# EAGLE design New_Multirotor_GPS_V1.2 (EAGLE 6.3)
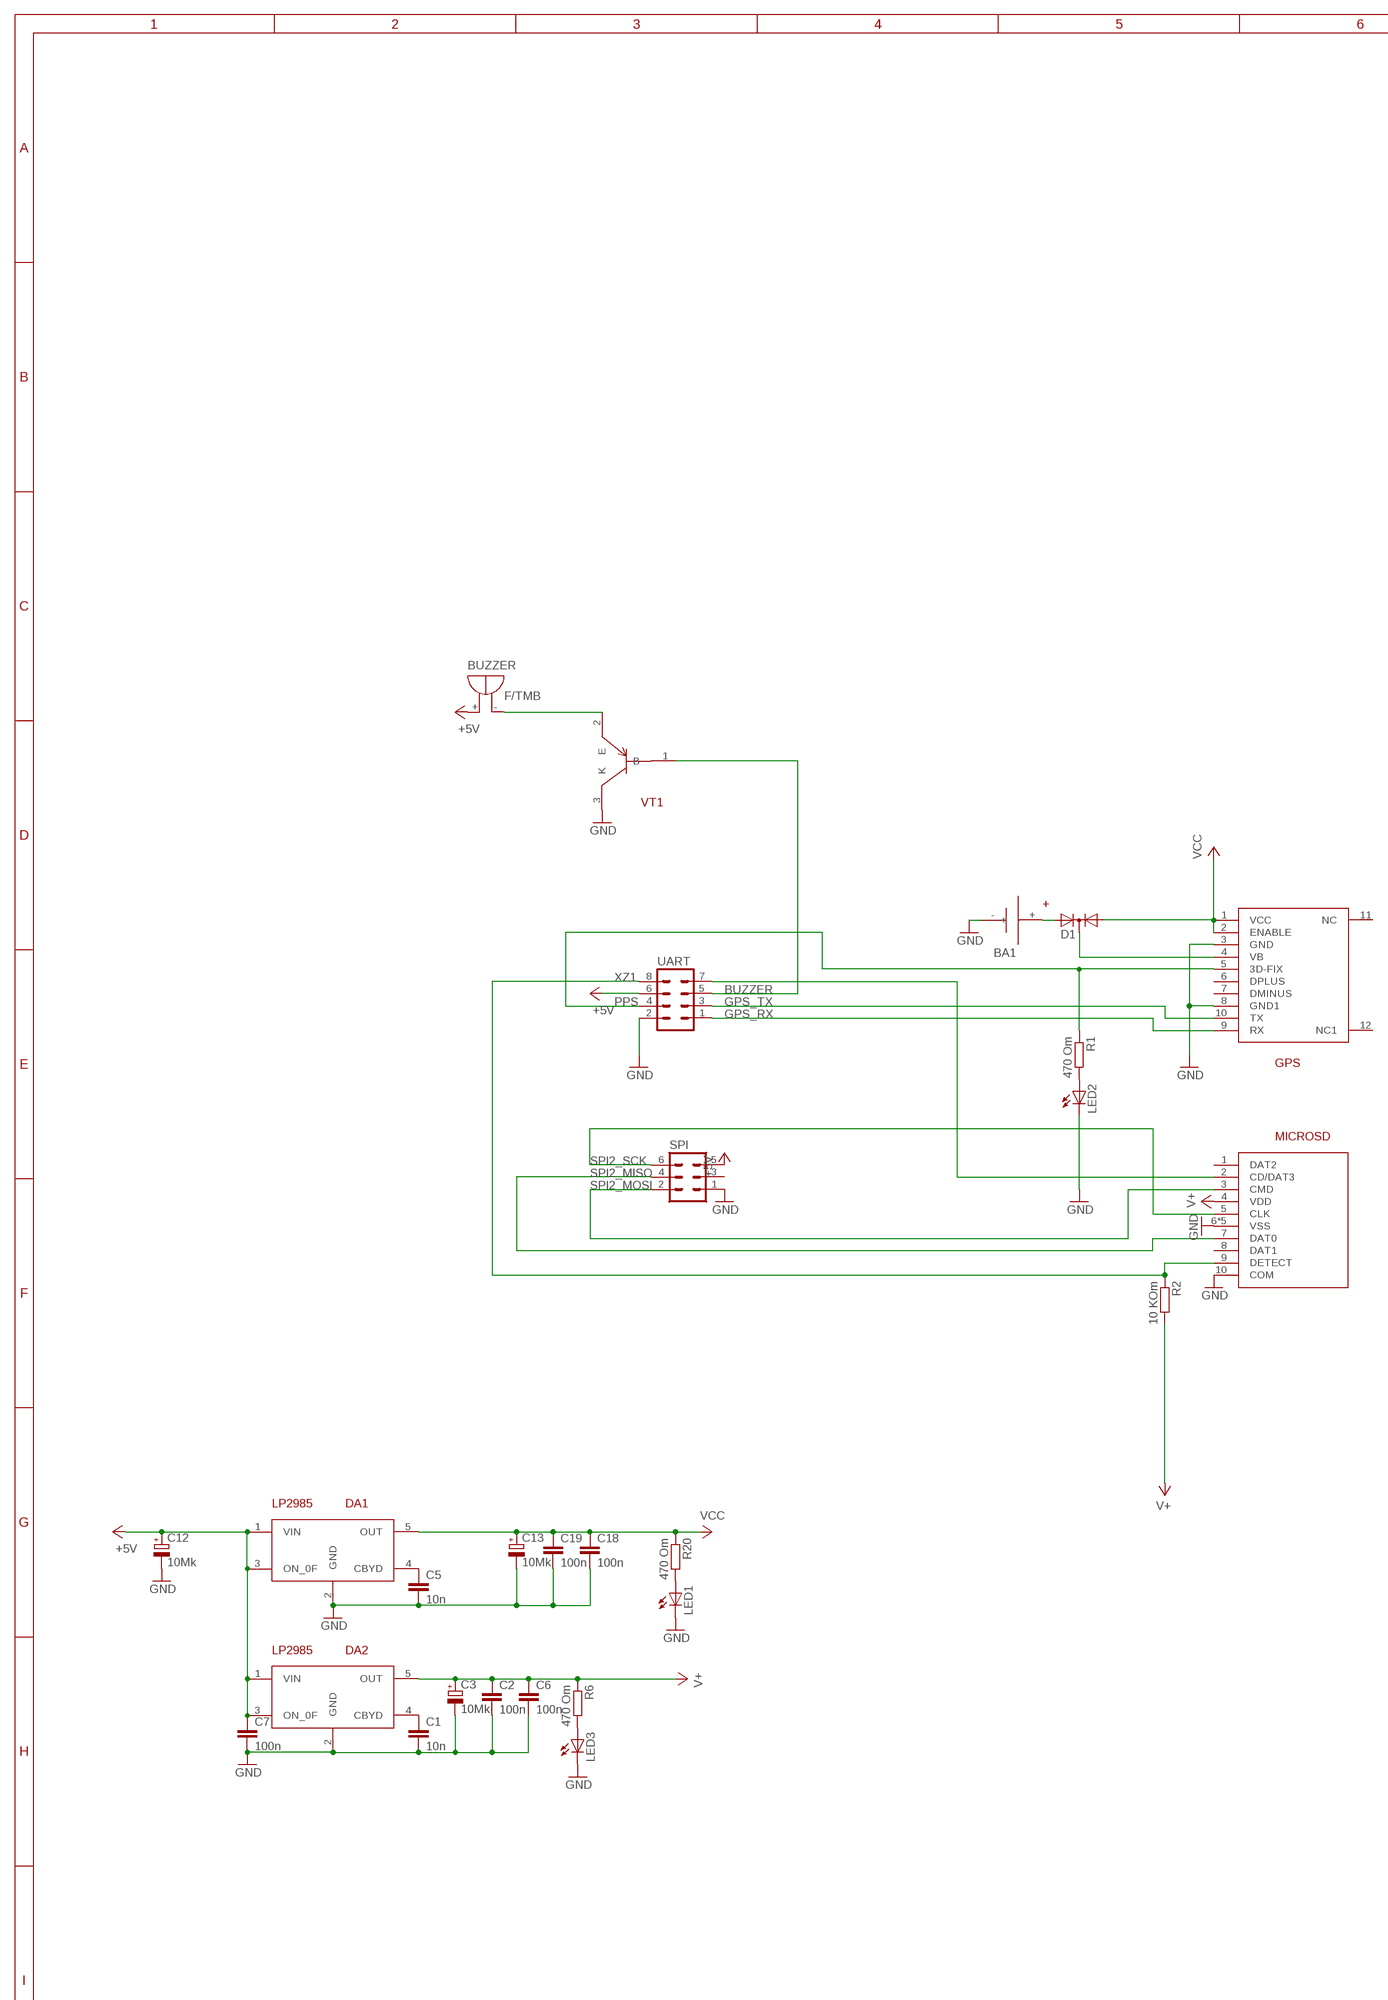
[diagram p0: schematic, sheet 1, part 1 of 2]
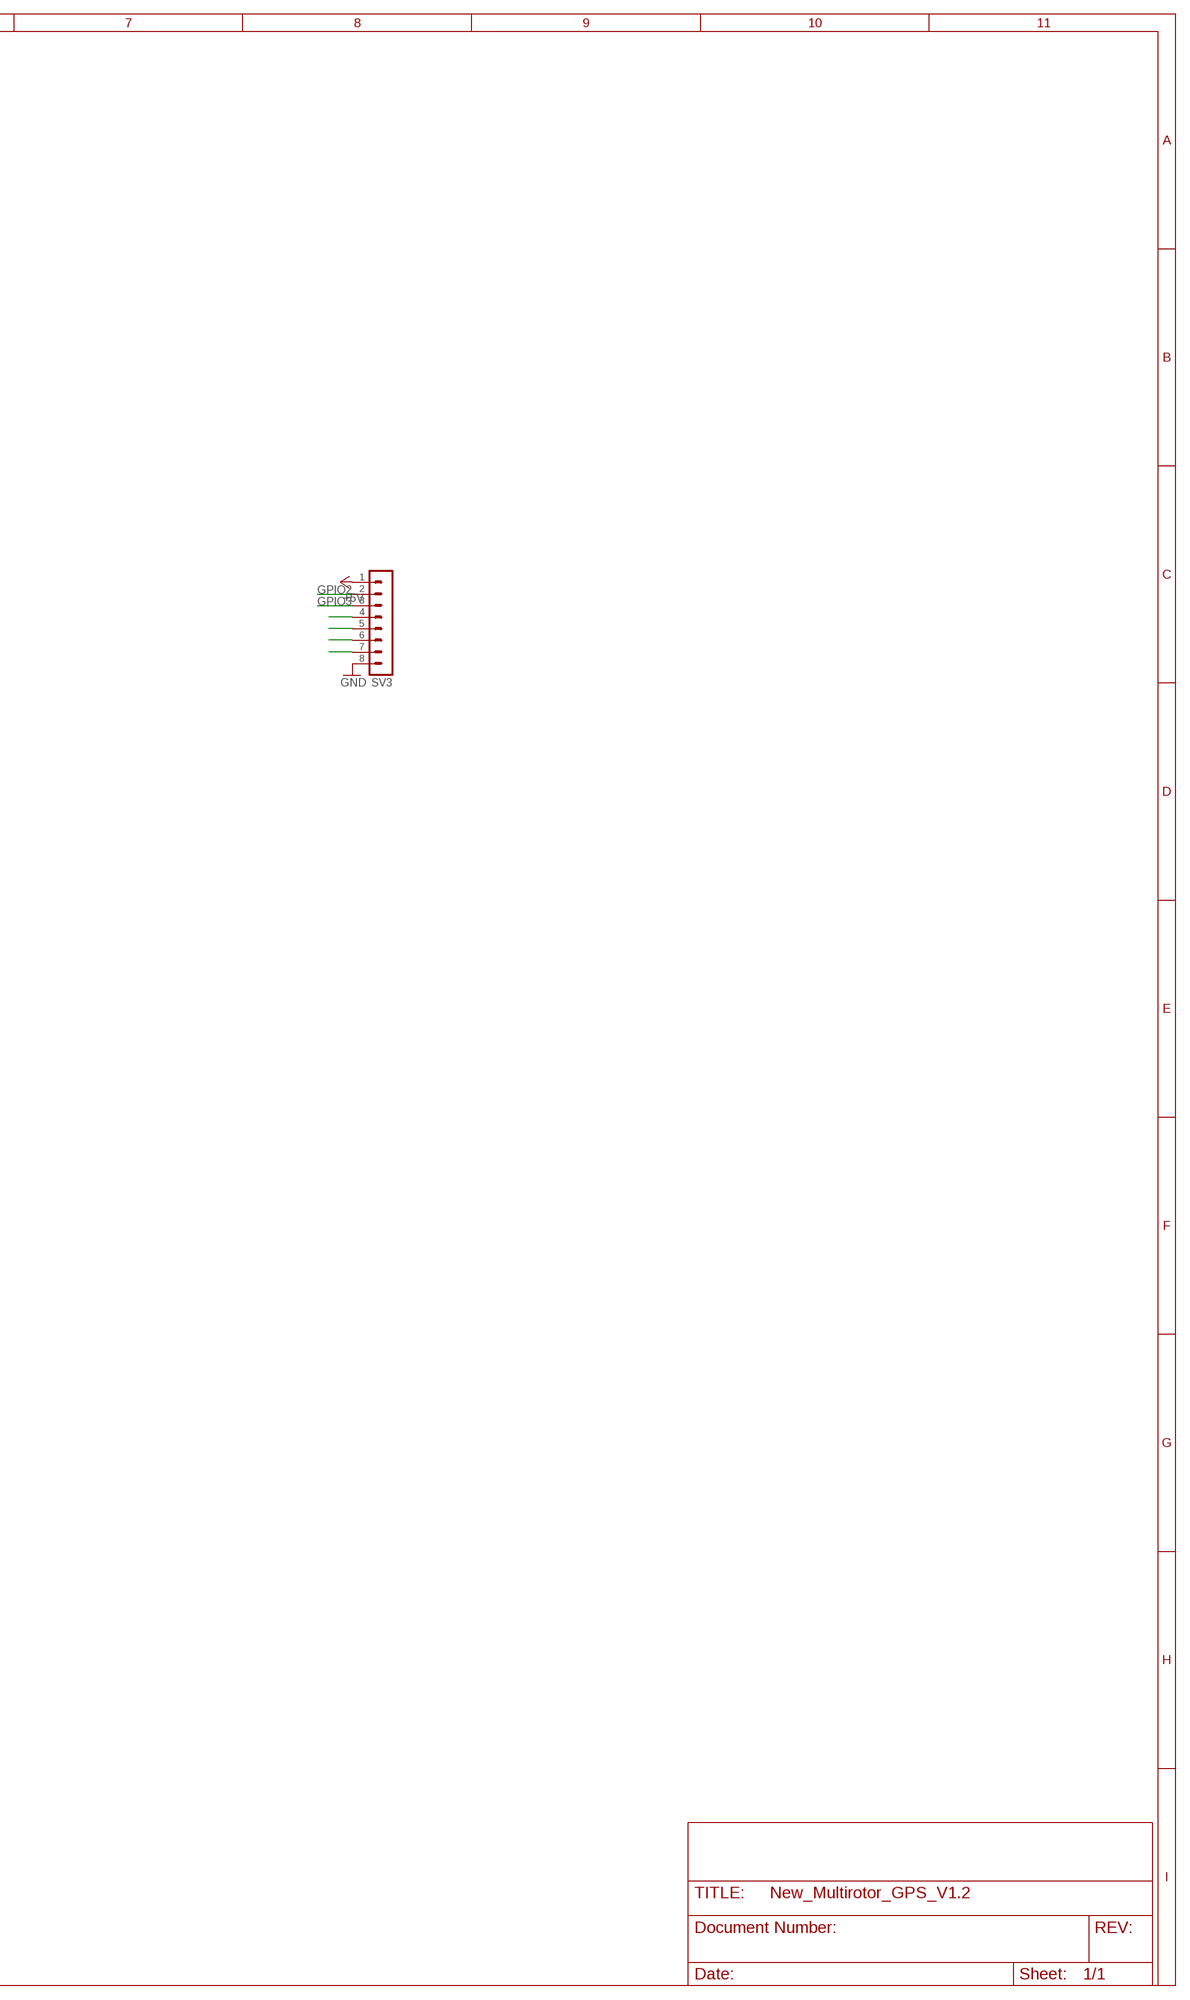
[diagram p1: schematic, sheet 1, part 2 of 2]

## Parts
BA1  BAT  [BAT]
BUZZER  F/TMB  [F/TMB]
C1  10n  C-EUC0603K  [C0603K]
C2  100n  C-EUC0603K  [C0603K]
C3  10Mk  CPOL-EUA/3216-18W  [A/3216-18W]
C5  10n  C-EUC0603K  [C0603K]
C6  100n  C-EUC0603K  [C0603K]
C7  100n  C-EUC0603K  [C0603K]
C12  10Mk  CPOL-EUA/3216-18W  [A/3216-18W]
C13  10Mk  CPOL-EUA/3216-18W  [A/3216-18W]
C18  100n  C-EUC0603K  [C0603K]
C19  100n  C-EUC0603K  [C0603K]
D1  DIODE-2AC|CASOT23  [SOT23]
DA1  LP2985  3.3  [SOT23-5L]
DA2  LP2985  3.3  [SOT23-5L]
GPS  FGPMMOPA6B  [FGPMMOPA6B]
LED1  LEDCHIPLED_0603  [CHIPLED_0603]
LED2  LEDCHIPLED_0603  [CHIPLED_0603]
LED3  LEDCHIPLED_0603  [CHIPLED_0603]
MICROSD  MICROCD_MAIN  [MICROSD_MAIN]
R1  470 Om  R-EU_R0603  [R0603]
R2  10 KOm  R-EU_R0603  [R0603]
R6  470 Om  R-EU_R0603  [R0603]
R20  470 Om  R-EU_R0603  [R0603]
SPI  MA03-2  [MA03-2]
SV3  MA08-1  [MA08-1]
UART  MA04-2  [MA04-2]
VT1  MMBT3906  [SOT23B-3]

## Nets
+5V: BUZZER.+ C7.1 C12.+ DA1.1(VIN) DA1.3(ON_0F) DA2.1(VIN) DA2.3(ON_0F) SPI.5 SV3.1 UART.6
ADC1: SV3.4
ADC2: SV3.5
ADC3: SV3.6
ADC4: SV3.7
BUZZER: UART.5 VT1.1(B)
GND: BA1.- C1.2 C2.2 C3.- C5.2 C6.2 C7.2 C12.- C13.- C18.2 C19.2 DA1.2(GND) DA2.2(GND) GPS.3(GND) GPS.8(GND1) LED1.C LED2.C LED3.C MICROSD.6(VSS) MICROSD.10(COM) MICROSD.11(VSS) MICROSD.12(VSS) MICROSD.13(VSS) MICROSD.14(VSS) SPI.1 SV3.8 UART.2 VT1.3(K)
GPIO2: SV3.2
GPIO3: SV3.3
GPS_RX: GPS.9(RX) UART.1
GPS_TX: GPS.10(TX) UART.3
N$1: LED2.A R1.2
N$2: BUZZER.- VT1.2(E)
N$3: D1.3(C) GPS.4(VB)
N$4: C1.1 DA2.4(CBYD)
N$5: BA1.+ D1.2(A2)
N$6: LED3.A R6.2
N$7: MICROSD.2(CD/DAT3) UART.7
N$13: LED1.A R20.2
N$52: C5.1 DA1.4(CBYD)
PPS: GPS.5(3D-FIX) R1.1 UART.4
SPI2_MISO: MICROSD.7(DAT0) SPI.4
SPI2_MOSI: MICROSD.3(CMD) SPI.2
SPI2_SCK: MICROSD.5(CLK) SPI.6
V+: C2.1 C3.+ C6.1 DA2.5(OUT) MICROSD.4(VDD) R2.2 R6.1
VCC: C13.+ C18.1 C19.1 D1.1(A1) DA1.5(OUT) GPS.1(VCC) GPS.2(ENABLE) R20.1
XZ1: MICROSD.9(DETECT) R2.1 UART.8
Unconnected: GPS.6(DPLUS) GPS.7(DMINUS) GPS.11(NC) GPS.12(NC1) MICROSD.1(DAT2) MICROSD.8(DAT1) SPI.3

## Library data of the parts
BA1 = pepelac:BAT
BUZZER = buzzer:F/TMB: BUZZER Source: Buerklin; OC_FARNELL: unknown; OC_NEWARK: unknown
C1 C2 C5-C7 C18 C19 = resistor:C-EU: CAPACITOR, European symbol
C3 C12 C13 = resistor:CPOL-EU: POLARIZED CAPACITOR, European symbol
D1 = diode:DIODE-2AC|CA: Dual DIODE Anode-Cathode|Cathode-Anode
DA1 DA2 = pepelac:3.3
GPS = pepelac:FGPMMOPA6B
LED1-LED3 = led:LED: LED OSRAM: - CHIPLED LG R971, LG N971, LY N971, LG Q971, LY Q971, LO R971, LY R971 LH N974, LH R974 LS Q976, LO Q976, LY Q976 LO Q996 - Hyper CHIPLED LW Q18S LB Q993, LB Q99A, LB R99A - SideLED LS A670, LO A670, LY A670, LG A670, LP A670 LB A673, LV A673, LT A673, LW A673 LH A674 LY A675 LS A676, LA A676, LO A676, LY A676, LW A676 LS A679, LY A679, LG A679 - Hyper Micro SIDELED® LS Y876, LA Y876, LO Y876, LY Y876 LT Y87S - SmartLED LW L88C, LW L88S LB L89C, LB L89S, LG L890 LS L89K, LO L89K, LY L89K LS L896, LA L896, LO L896, LY L896 - TOPLED LS T670, LO T670, LY T670, LG T670, LP T670 LSG T670, LSP T670, LSY T670, LOP T670, LYG T670 LG T671, LOG T671, LSG T671 LB T673, LV T673, LT T673, LW T673 LH T674 LS T676, LA T676, LO T676, LY T676, LB T676, LH T676, LSB T676, LW T676 LB T67C, LV T67C, LT T67C, LS T67K, LO T67K, LY T67K, LW E67C LS E67B, LA E67B, LO E67B, LY E67B, LB E67C, LV E67C, LT E67C LW T67C LS T679, LY T679, LG T679 LS T770, LO T770, LY T770, LG T770, LP T770 LB T773, LV T773, LT T773, LW T773 LH T774 LS E675, LA E675, LY E675, LS T675 LS T776, LA T776, LO T776, LY T776, LB T776 LHGB T686 LT T68C, LB T68C - Hyper Mini TOPLED® LB M676 - Mini TOPLED Santana® LG M470 LS M47K, LO M47K, LY M47K Source: http://www.osram.convergy.de LUXEON: - LUMILED® LXK2-PW12-R00, LXK2-PW12-S00, LXK2-PW14-U00, LXK2-PW14-V00 LXK2-PM12-R00, LXK2-PM12-S00, LXK2-PM14-U00 LXK2-PE12-Q00, LXK2-PE12-R00, LXK2-PE12-S00, LXK2-PE14-T00, LXK2-PE14-U00 LXK2-PB12-K00, LXK2-PB12-L00, LXK2-PB12-M00, LXK2-PB14-N00, LXK2-PB14-P00, LXK2-PB14-Q00 LXK2-PR12-L00, LXK2-PR12-M00, LXK2-PR14-Q00, LXK2-PR14-R00 LXK2-PD12-Q00, LXK2-PD12-R00, LXK2-PD12-S00 LXK2-PH12-R00, LXK2-PH12-S00 LXK2-PL12-P00, LXK2-PL12-Q00, LXK2-PL12-R00 Source: www.luxeon.com KINGBRIGHT: KA-3528ASYC Source: www.kingbright.com
MICROSD = pepelac:MICROCD_MAIN
R1 R2 R6 R20 = resistor:R-EU_: RESISTOR, European symbol
SPI = con-lstb:MA03-2: PIN HEADER; OC_FARNELL: unknown; OC_NEWARK: unknown
SV3 = con-lstb:MA08-1: PIN HEADER; OC_FARNELL: unknown; OC_NEWARK: unknown
UART = con-lstb:MA04-2: PIN HEADER; OC_FARNELL: unknown; OC_NEWARK: unknown
VT1 = pepelac:MMBT3906

## Net classes
0 Def: width 0.406 mm, clearance 0.152 mm

## Board
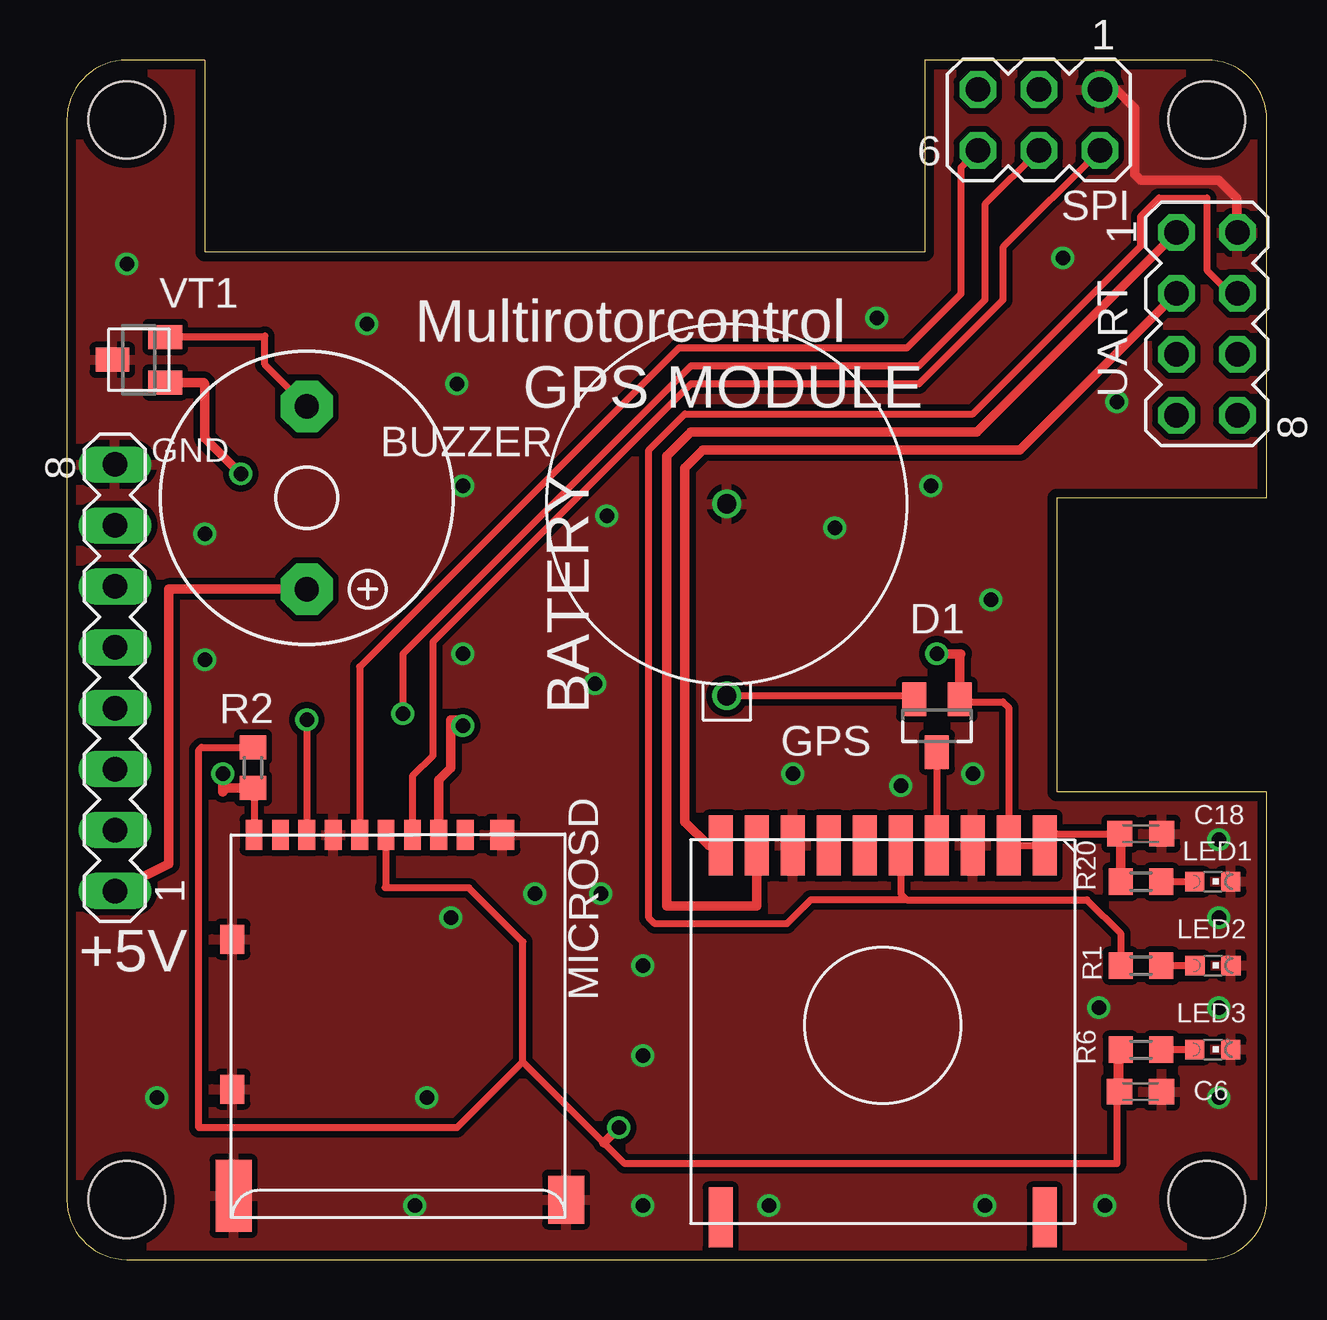
[diagram p2: board, top side]
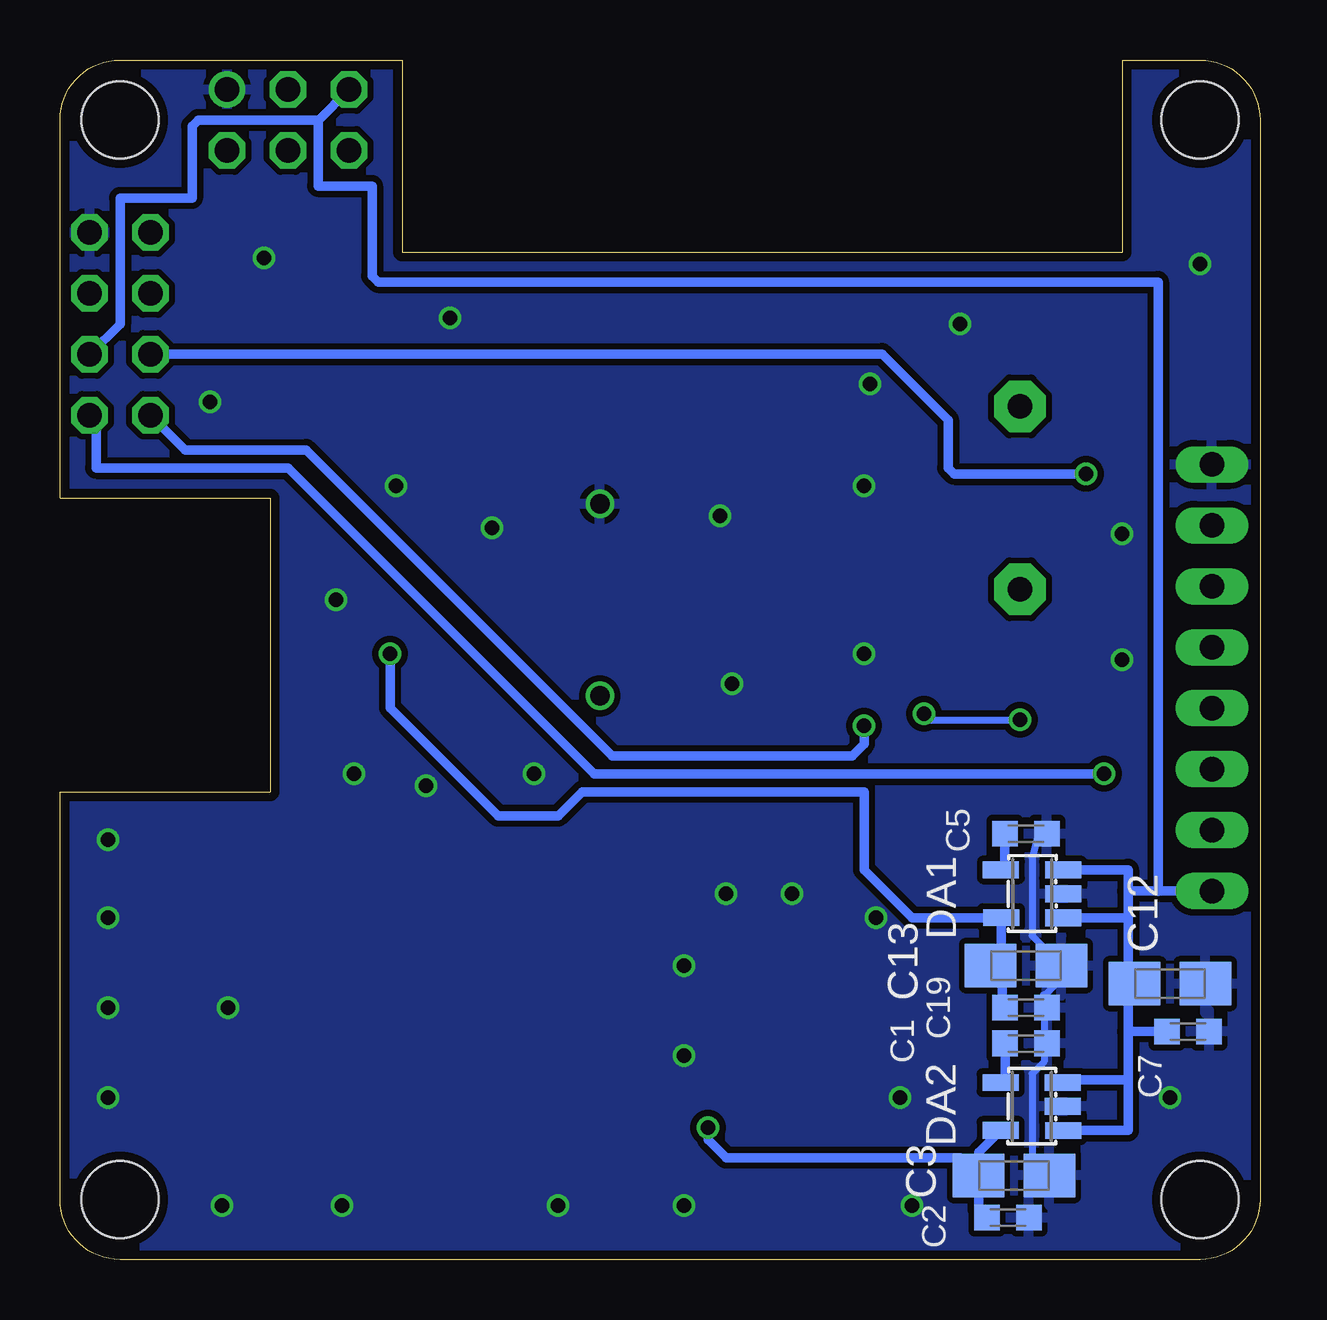
[diagram p3: board, bottom side, seen from below]

Size 50 x 50 mm. Coordinates in mm from the lower left corner, seen from the top.
Outline: 0,47.5 0,2.5 arc90 2.5,0 47.5,0 arc90 50,2.5 50,19.5 41.25,19.5 41.25,31.75 50,31.75 50,47.5 arc90 47.5,50 35.75,50 35.75,42 5.75,42 5.75,50 2.5,50 arc90 0,47.5
Copper layers (1*16): Top 0.0356mm / dielectric 1.5011mm / Bottom 0.0356mm
Design rules "LaenPCBOrder": minimum track width 6mil, minimum drill 13mil, track to track 6mil, track to pad 6mil, pad to pad 6mil, via to via 6mil, smd to smd 6mil, copper to edge 15mil, drill to drill 6mil, minimum pad ring 7mil, minimum via ring 7mil, stop-mask expansion 4mil, vias tented up to drill 0mil, thermal gap 10mil
Holes 3.2 mm at 2.5,2.5 47.5,2.5 47.5,47.5 2.5,47.5

### Footprints (pad centres in the part's own frame; a part is rotated, then mirrored left to right if it is on the bottom)
BAT = drill 0.8: + -8,0; - 0,0
F/TMB = drill 1.016 pad 2.159 octagon: + 3.81,0; - -3.81,0
C0603K = smd 1.05 x 1.08: 1 -0.875,0; 2 0.875,0
A/3216-18W = smd 2.15 x 1.8: + 1.475,0; - -1.475,0
SOT23 = smd 1 x 1.4: 1 -0.95,-1.1; 2 0.95,-1.1; 3 0,1.1
SOT23-5L = smd 0.7 x 1.5: 1 -1.002,-1.305; 2 0,-1.3; 3 0.997,-1.294; 4 0.991,1.3; 5 -0.998,1.293
FGPMMOPA6B = smd 2.5 x 1: 1 -7.5,6.75; 2 -7.5,5.25; 3 -7.5,3.75; 4 -7.5,2.25; 5 -7.5,0.75; 6 -7.5,-0.75; 7 -7.5,-2.25; 8 -7.5,-3.75; 9 -7.5,-5.25; 10 -7.5,-6.75; 11 8,6.75; 12 8,-6.75
CHIPLED_0603 = smd 0.8 x 0.8: A 0,-0.75; C 0,0.75
MICROSD_MAIN = smd 0.7 x 1.25: 1 -2.15,5.95; 2 -3.25,5.95; 3 -4.35,5.95; 4 -5.45,5.95; 5 -6.55,5.95; 6 -7.65,5.95; 7 -8.75,5.95; 8 -9.85,5.95; 9 -10.95,5.95 | smd 1 x 1.2: 10 -11.85,1.6; 11 -11.85,-4.65 | smd 1.5 x 3: 12 -11.8,-9.1 | smd 1.5 x 2: 13 2.05,-9.25 | smd 1 x 1.25: 14 -0.6,5.95
R0603 = smd 1 x 1.1: 1 -0.85,0; 2 0.85,0
MA03-2 = drill 1.016: 1 -2.54,-1.27 | drill 1.016 octagon: 2 -2.54,1.27; 3 0,-1.27; 4 0,1.27; 5 2.54,-1.27; 6 2.54,1.27
MA08-1 = drill 1.016 long: 1 -8.89,0; 2 -6.35,0; 3 -3.81,0; 4 -1.27,0; 5 1.27,0; 6 3.81,0; 7 6.35,0; 8 8.89,0
MA04-2 = drill 1.016 octagon: 1 -3.81,-1.27; 2 -3.81,1.27; 3 -1.27,-1.27; 4 -1.27,1.27; 5 1.27,-1.27; 6 1.27,1.27; 7 3.81,-1.27; 8 3.81,1.27
SOT23B-3 = smd 1 x 1.4: 1 -0.95,-1.1; 2 0.95,-1.1; 3 0,1.1

### Placement (x,y rotation side)
BA1  27.5,31.5 90 top
BUZZER  10,31.75 270 top
C1  9.75,9 0 bottom
C2  10.5,1.75 0 bottom
C3  10.25,3.5 180 bottom
C5  9.75,17.75 0 bottom
C6  44.74,7 0 top
C7  3,9.5 0 bottom
C12  3.75,11.5 180 bottom
C13  9.75,12.25 180 bottom
C18  44.75,17.75 0 top
C19  9.75,10.5 0 bottom
D1  36.25,22.25 180 top
DA1  9.5,15.25 90 bottom
DA2  9.51,6.38 90 bottom
GPS  33.99,9.75 270 top
LED1  47.75,15.75 270 top
LED2  47.76,12.25 270 top
LED3  47.75,8.75 270 top
MICROSD  18.75,11.75 0 top
R1  44.75,12.25 0 top
R2  7.75,20.5 90 top
R6  44.75,8.75 0 top
R20  44.75,15.75 0 top
SPI  40.5,47.5 180 top
SV3  2,24.25 90 top
UART  47.5,39 270 top
VT1  3,37.51 90 top

### Tracks (layer width: path | path; a pad name or v marks a point on that pad's centre or on a via)
+5V
  Top 0.4: BUZZER.+ 4.25,27.94 4.25,16.5 SV3.1
  Bottom 0.4: 5.5,15.36 SV3.1 3.14,15.36 4.25,15.35 4.25,40.75 36.75,40.75 37,41 37,44.75 39.25,44.75 39.25,47.5 | 5.5,15.36 5.5,14.24 | 5.5,14.24 5.5,12 5.22,12 C12.+ 5.5,11.5 | DA1.1 5.5,14.24 | DA1.3 5.5,16.24 | 5.5,16.24 5.5,16.25 | 5.5,16.24 5.5,15.36 | 5.5,11.5 | 5.5,11.5 5.5,9.5 | 5.5,9.5 5.5,7.5 | 5.5,7.5 8.22,7.5 DA2.3 | DA2.1 5.5,5.38 5.5,7.5 | C7.1 5.5,9.5 | 39.25,47.5 44.25,47.5 44.5,47.25 44.5,44.25 47.5,44.25 47.5,39 UART.6 | UART.6 | SPI.5 39.23,47.5 39.25,47.5
BUZZER  (via drill 0.6)
  Top 0.4: v7.25,32.75 5.75,34.25 5.75,36.5 5.7,36.55 VT1.1
  Bottom 0.4: UART.5 46.21,37.75 15.75,37.75 13,35 13,33 12.75,32.75 v7.25,32.75
GND  (via drill 0.6)
  Top 0.4: UART.2 48.75,42.83 48.75,44.25 48,45 44.75,45 44.5,45.25 44.5,48 43.73,48.77 SPI.1
  Bottom 0.3: 9.25,17.75 9.5,16.75 9.5,13.5 8.25,12.25 8.25,11.75 9,11 9,8.25 9.5,7.75 9.5,4.25 9,3.75
  Bottom 0.4: C19.2 9,10.5 9,11 | C3.- 9,3.73 9,3.75
  other vias: 24,2.25 29.25,2.25 38.25,2.25 2.5,41.5 41.5,41.75 15,6.75 16,14.25 19.5,15.25 14.5,2.25 3.75,6.75 5.75,25 5.75,30.25 12.5,39 22.5,31 48,17.5 48,6.75 43.25,2.25 30.25,20.25 37.75,20.25 48,14.25 48,10.5 24,8.5 43,10.5 43.75,35.75 32,30.5 38.5,27.5 34.75,19.75 24,12.25 22.25,15.25 22,24 16.5,25.25 16.25,36.5 16.5,32.25 33.75,39.25 36,32.25
  pour Top (isolate 0.254): 5.75,50 2.5,50 arc90 0,47.5 0,2.75 arc90 2.75,0 47.25,0 arc90 50,2.75 50,19.5 41.25,19.5 41.25,31.75 50,31.75 50,47.5 arc90 47.5,50 35.75,50 35.75,42 5.75,42
  pour Bottom (isolate 0.254): 5.75,50 2.5,50 arc90 0,47.5 0,2.75 arc90 2.75,0 47.25,0 arc90 50,2.75 50,19.5 41.25,19.5 41.25,31.75 50,31.75 50,47.5 arc90 47.5,50 35.75,50 35.75,42 5.75,42
GPS_RX
  Top 0.4: UART.1 37.92,34.5 26,34.5 25,33.5 25,14.75 28.75,14.75 28.74,14.76 GPS.9
GPS_TX
  Top 0.4: UART.3 39.71,33.75 26.5,33.75 25.75,33 25.75,18.25 26.75,17.25 GPS.10
N$1
  Top 0.3: R1.2 LED2.A
N$2
  Top 0.3: BUZZER.- 8.25,37.31 8.25,38.5 8.21,38.45 VT1.2
N$3
  Top 0.3: D1.3 36.24,21.14 GPS.4
N$4
  Bottom 0.4: DA2.4 10.62,7.37 C1.1
N$5
  Top 0.3: D1.2 35.16,23.5 BA1.+
N$6
  Top 0.3: R6.2 LED3.A
N$7  (via drill 0.6)
  Top 0.4: v16.5,22.25 16.25,22.5 16,22.5 16,20.5 15.5,20 MICROSD.2
  Bottom 0.4: UART.7 44.79,33.75 39.75,33.75 27,21 17,21 16.5,21.5 v16.5,22.25
N$13
  Top 0.3: R20.2 LED1.A
N$52
  Bottom 0.4: DA1.4 10.63,16.24 C5.1
PPS
  Top 0.3: GPS.5 34.75,15.25 35,15 | 35,15 42.5,15 43.91,13.6 R1.1 | 35,15 31,15 30,14 24.5,14 24.25,14.25 24.25,33.75 25.75,35.25 37.75,35.25 44.75,42.25 44.75,43.5 45.5,44.25 47.5,44.25 47.5,41.25 48.48,40.27 UART.4
SPI2_MISO  (via drill 0.6)
  Top 0.3: SPI.4 38.25,43.98 38.25,40 35.5,37.25 26,37.25 14,25.25 v14,22.75 | v10,22.5 MICROSD.7
  Bottom 0.3: v14,22.75 13.75,22.5 v10,22.5
SPI2_MOSI
  Top 0.3: SPI.2 39,42.19 39,40 35.5,36.5 26,36.5 15.25,25.75 15.25,21 14.4,20.15 MICROSD.3
SPI2_SCK
  Top 0.3: SPI.6 37.25,45.52 37.25,40.25 35,38 25.5,38 12.2,24.7 MICROSD.5
V+  (via drill 0.6)
  Top 0.3: R6.1 43.86,8.7 | 43.86,8.7 C6.1 | 43.86,8.7 43.75,8.59 43.75,4 23.25,4 22.38,4.88 19,8.25 | 19,8.25 19,13.25 16.75,15.5 13.25,15.5 13.3,15.55 MICROSD.4 | 19,8.25 16.25,5.5 5.5,5.5 5.5,21.25 5.6,21.35 R2.2
  Top 0.4: v23,5.5 22.38,4.88
  Bottom 0.4: C2.1 11.72,2.1 C3.+ | DA2.5 11.72,4.46 C3.+ | C3.+ 12.47,4.25 22.25,4.25 23,5 v23,5.5
VCC  (via drill 0.6)
  Top 0.3: D1.1 37.3,23.25 39,23.25 39.24,23.01 GPS.2 GPS.1 41.23,17.75 C18.1
  Top 0.4: v36.25,25.25 37.25,25.25 37.2,25.2 D1.1 | C18.1 43.9,17.72 R20.1
  Bottom 0.4: C19.1 10.75,10.5 10.75,11.75 11.23,11.75 C13.+ 10.79,12.25 DA1.5 14.5,14.25 16.5,16.25 16.5,19.5 28.25,19.5 29.25,18.5 31.75,18.5 36.25,23 v36.25,25.25
XZ1  (via drill 0.6)
  Top 0.3: R2.1 7.8,19.61 MICROSD.9
  Top 0.4: v6.5,20.25 6.5,19.5 6.65,19.65 R2.1
  Bottom 0.4: UART.8 48.5,34.92 48.5,33 40.5,33 27.75,20.25 v6.5,20.25

### Text on the board
tNames: Multirotorcontrol | GPS MODULE | GND | BATERY | +5V